# Altium schematic sheet 35.SchDoc
size 513 x 386 mm
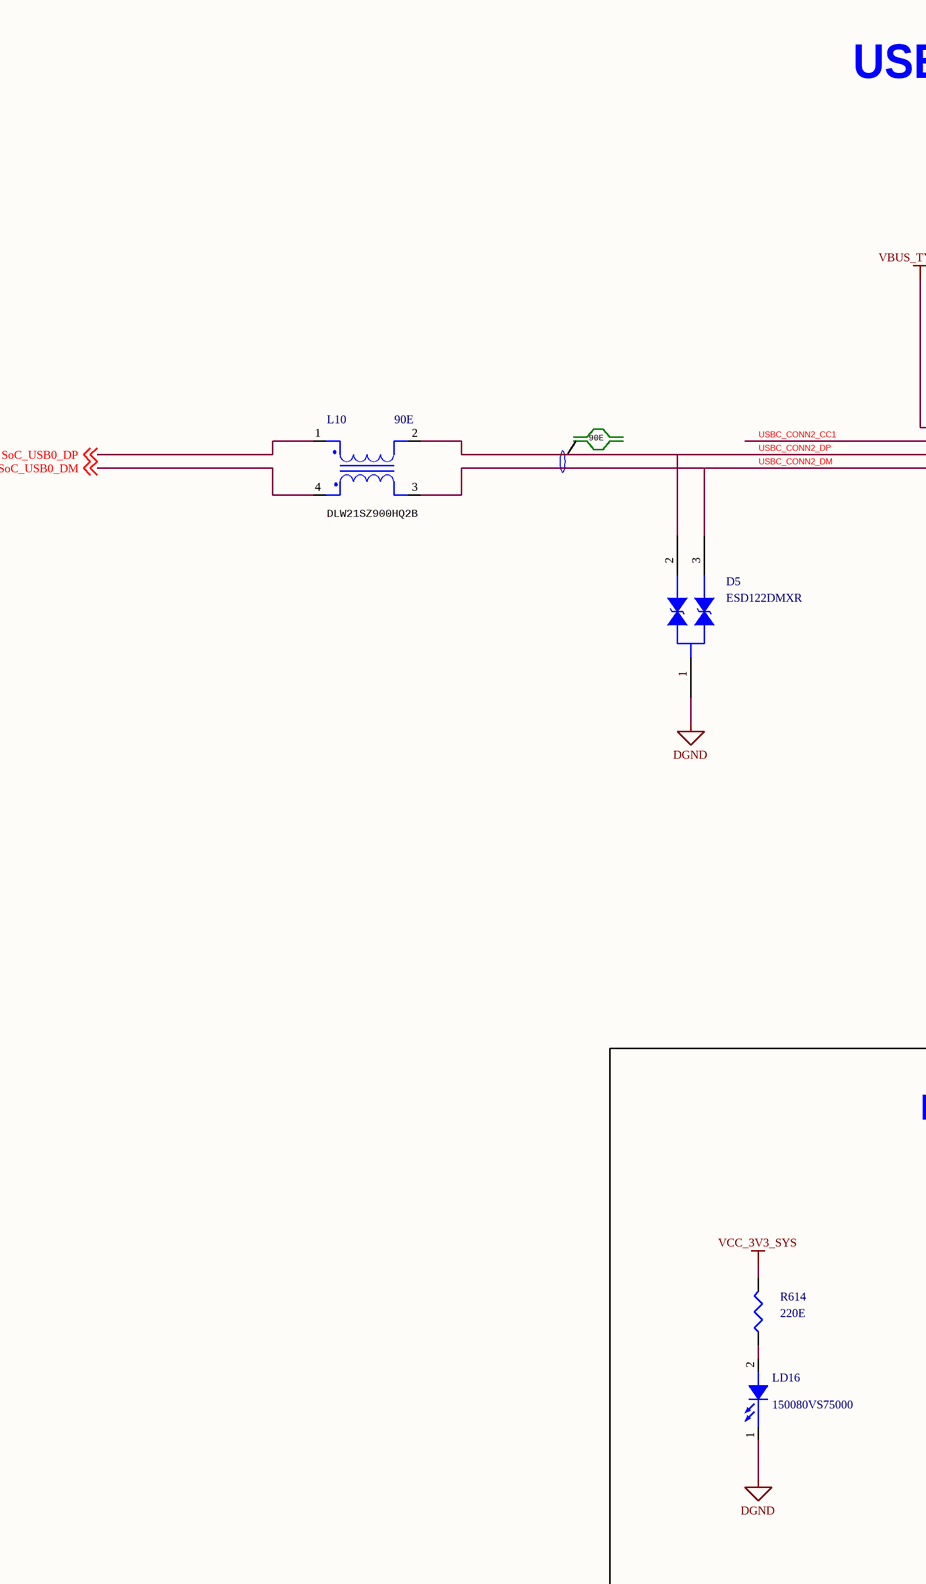
[diagram p0: 35.SchDoc, left]
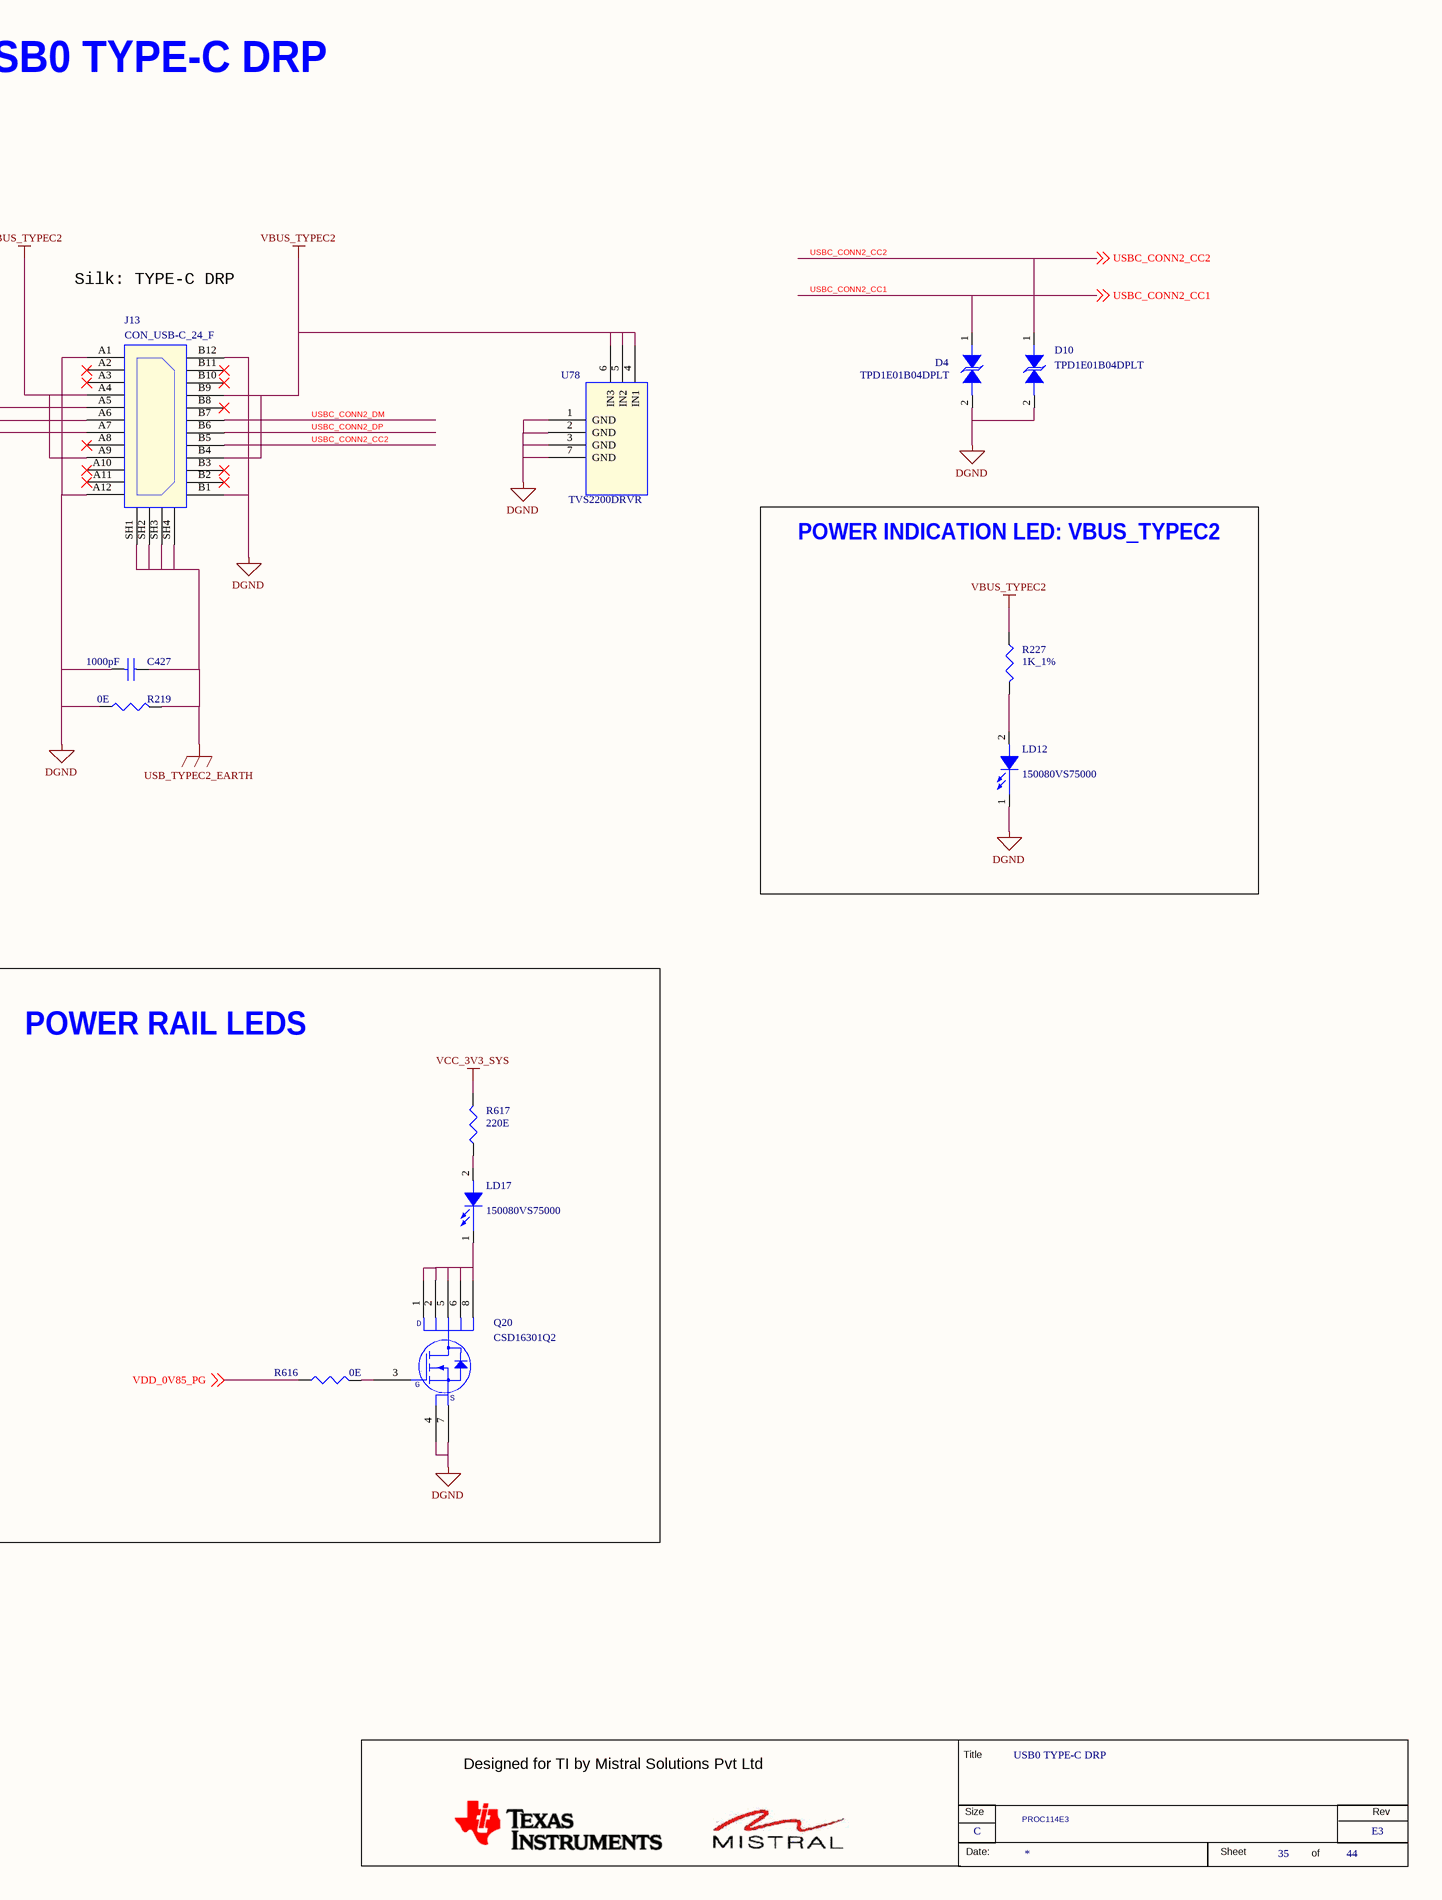
[diagram p1: 35.SchDoc, right]

## Parts
*  RevCode: E3  Title: USB0 TYPE-C DRP  Page Size: C  Page Number: 35  Page Count: 44  Variant Name: PROC114E3  (hidden comment: MISTRAL_TITLEBLK_CSIZE)  (graphical)
C427  1000pF  [CAP1206_1-75]
D4  TPD1E01B04DPLT  [DIO_DFN0201_0-4]
D5  ESD122DMXR  [X2SON3_ESD122DMX_30X40_0-4]
D10  TPD1E01B04DPLT  [DIO_DFN0201_0-4]
J13  CON_USB-C_24_F  [CON_USBC24_2012670_S_R_S_3-9]
L10  90E  [IND4_DLW21H_90X60_SMD_1-4]
LD12  150080VS75000  [LED_150080VS75000_80X50_SMD_0-8]
LD16  150080VS75000  [LED_150080VS75000_80X50_SMD_0-8]
LD17  150080VS75000  [LED_150080VS75000_80X50_SMD_0-8]
Q20  CSD16301Q2  [WSON6_CSD13202Q2_80X80_0-8]
R219  0E  [RES0603_0-75]
R227  1K_1%  [RES0402_0-5]
R614  220E  [RES0402_0-5]
R616  0E  [RES0402_0-5]
R617  220E  [RES0402_0-5]
U78  TVS2200DRVR  [SON6_25-59_85X85_0-8]

## Blocks framed on the sheet
POWER INDICATION LED: VBUS_TYPEC2: LD12 R227
POWER RAIL LEDS: LD16 LD17 Q20 R614 R616 R617

## Nets
DGND: C427.2 D4.2(ANODE) D5.1(GND) D10.2(ANODE) J13.A1(GND) J13.A12(GND) J13.B1(GND) J13.B12(GND) LD12.1(CATHODE) LD16.1(CATHODE) Q20.4(S1) Q20.7(S2) R219.2 U78.1(GND) U78.2(GND) U78.3(GND) U78.7(GND)
USB_TYPEC2_EARTH: C427.1 J13.SH1 J13.SH2 J13.SH3 J13.SH4 R219.1
VBUS_TYPEC2: J13.A4(VBUS1) J13.A9(VBUS2) J13.B4(VBUS3) J13.B9(VBUS4) R227.1 U78.4(IN1) U78.5(IN2) U78.6(IN3)
VCC_3V3_SYS: R614.2 R617.2
SoC_USB0_DM: L10.4(OUT2) ; off-sheet SoC_USB0_DM
SoC_USB0_DP: L10.1(IN1) ; off-sheet SoC_USB0_DP
USBC_CONN2_CC1: D4.1(CATHODE) J13.A5(CC1) ; off-sheet USBC_CONN2_CC1
USBC_CONN2_CC2: D10.1(CATHODE) J13.B5(CC2) ; off-sheet USBC_CONN2_CC2
USBC_CONN2_DM: D5.3(IO2) J13.A7(D-_1) J13.B7(D-_2) L10.3(OUT1)
USBC_CONN2_DP: D5.2(IO1) J13.A6(D+_1) J13.B6(D+_2) L10.2(IN2)
VDD_0V85_PG: R616.1 ; off-sheet VDD_0V85_PG
NetLD12_2: LD12.2(ANODE) R227.2
NetLD16_2: LD16.2(ANODE) R614.1
NetLD17_1: LD17.1(CATHODE) Q20.1(D1) Q20.2(D2) Q20.5(D3) Q20.6(D4) Q20.8(D5)
NetLD17_2: LD17.2(ANODE) R617.1
NetQ20_3: Q20.3(G) R616.2

Not connected (* = marked no-connect by the designer): J13 A2(TX1+)* A3(TX1-)* A8(SBU1)* A10(RX2-)* A11(RX2+)* B2(TX2+)* B3(TX2-)* B8(SBU2)* B10(RX1-)* B11(RX1+)*

## Notes on the sheet
- USB0 TYPE-C DRP
- Silk: TYPE-C DRP
- 90E
- (near L10) DLW21SZ900HQ2B
- (in symbol MISTRAL_TITLEBLK_CSIZE) Title; Designed for TI by Mistral Solutions Pvt Ltd; Size; Rev; Date:; Sheet; of
- (in symbol MOSFET_CSD17313Q2) D; S

## Library data of the parts
* = MISTRAL_TITLEBLK_CSIZE: Issue: 1.0; Page Create Date: March  8, 1995; Page Modify Date: *
C427 = CAP_Dup2: CAP CERAMIC 1000pF 2KV 10% X7R 1206; Mistral Part No: 120015080006-R; Mfr_name: AVX CORPORATION; Mfr_part_number: 1206GC102KAT1A; Part_type: CAPACITORS\CERAMIC; Project: ADR1B; Customs_HS_Code: 85322990; Custom_Duty: 15%; Wattage: NA; Tolerance: 10%; Voltage: 2KV; Package: 1206; Distributor_name: DIGIKEY; Distributor_part_number: 478-2956-1-ND; Height: 1.52MM; Weight: 16.2mg; Temperature: -55°C+125°C; Datasheet: Y:\MIS_DATABASE\DATASHEETS\CAPACITORS\AVX_HV-MLC.PDF; Crtd /date: MAZHAR/281106; Chkd/date: SHREESHAIL/291106; Library Ref: CAP; Footprint Ref: CAP1206_1-75; Library Path: Y:\MIS_DATABASE\Library\ALTIUM_TOOL\SCHEMATICS_PARTS\MS_DISCRETE_Library.schlib; Footprint Path: Y:\MIS_DATABASE\Library\ALTIUM_TOOL\PCB_FOOTPRINTS\Altium_Footprint_Lib.PcbLib; MECHANICAL 3D STEP FILE: CAP1206_1-75; PCB Footprint: CAP1206_1-75
D4 = DIODE_TVS_DUAL: DIODE 1CH ESD PROTECTION FOR USB TYPE-C AND THUNDERBOLT3 X2SON2; Mistral Part No: 130020090037-R; Mfr_name: TEXAS INSTRUMENTS; Part_type: DIODE\TVS; Project: AM64X_SKEVM; Tolerance: NA; Customs_HS_Code: 85412900; Custom_Duty: 15%; Footprint Ref: DIO_DFN0201_0-4; Mfr_part_number: TPD1E01B04DPLT; Voltage: NA; Wattage: NA; Package: X2SON2; Distributor_name: DIGIKEY; Distributor_part_number: 296-44484-1-ND; Library Ref: DIODE_TVS_DUAL; Height: 0.32MM; Weight: 0.2mg; Temperature: -40°C+125°C; Datasheet: Y:\MIS_DATABASE\DATASHEETS\DISCRETES\DIODES\TPD1E01B04.PDF; Crtd /date: ALVY/230920; Chkd/date: MANIRAJA/230920; MECHANICAL 3D STEP FILE: DIO_DFN0201_0-4; Library Path: Y:\MIS_DATABASE\Library\ALTIUM_TOOL\SCHEMATICS_PARTS\MS_DISCRETE_Library.schlib; Footprint Path: Y:\MIS_DATABASE\Library\ALTIUM_TOOL\PCB_FOOTPRINTS\Altium_Footprint_Lib.PcbLib; PCB Footprint: DIO_DFN0201_0-4
D5 = DIODE_ESD122DMXR: DIODE 2-CH ESD PROTECTION FOR USB TYPE-C AND HDMI 2.0 X2SON-3; Part_type: DIODE\TVS; Mfr_name: TEXAS INSTRUMENTS; Mistral Part No: 130017080015-R; Custom_Duty: 15%; Customs_HS_Code: 85412900; Wattage: NA; Project: TI_SVB_CONTROLLER CARD; MECHANICAL 3D STEP FILE: X2SON3_ESD122DMX_30X40_0-4; Chkd/date: MANIRAJA/140817; Crtd /date: MANIRAJA/140817; Datasheet: Y:\MIS_DATABASE\DATASHEETS\DISCRETES\DIODES\ESD122XX.PDF; Temperature: -40°C+125°C; Weight: NA; Height: 0.40MM; Library Ref: DIODE_ESD122DMXR; Distributor_part_number: ESD122DMXR-ND; Distributor_name: DIGIKEY; Package: X2SON-3; Voltage: NA; Tolerance: NA; Mfr_part_number: ESD122DMXR; PCB Footprint: X2SON3_ESD122DMX_30X40_0-4
D10 = DIODE_TVS_DUAL: DIODE 1CH ESD PROTECTION FOR USB TYPE-C AND THUNDERBOLT3 X2SON2; Part_type: DIODE\TVS; Mfr_name: TEXAS INSTRUMENTS; Mistral Part No: 130020090037-R; Custom_Duty: 15%; Customs_HS_Code: 85412900; Wattage: NA; Project: AM64X_SKEVM; Footprint Path: Y:\MIS_DATABASE\Library\ALTIUM_TOOL\PCB_FOOTPRINTS\Altium_Footprint_Lib.PcbLib; Library Path: Y:\MIS_DATABASE\Library\ALTIUM_TOOL\SCHEMATICS_PARTS\MS_DISCRETE_Library.schlib; MECHANICAL 3D STEP FILE: DIO_DFN0201_0-4; Chkd/date: MANIRAJA/230920; Crtd /date: ALVY/230920; Datasheet: Y:\MIS_DATABASE\DATASHEETS\DISCRETES\DIODES\TPD1E01B04.PDF; Temperature: -40°C+125°C; Weight: 0.2mg; Height: 0.32MM; Library Ref: DIODE_TVS_DUAL; Distributor_part_number: 296-44484-1-ND; Distributor_name: DIGIKEY; Package: X2SON2; Voltage: NA; Tolerance: NA; Mfr_part_number: TPD1E01B04DPLT; Footprint Ref: DIO_DFN0201_0-4; PCB Footprint: DIO_DFN0201_0-4
J13 = CON_USB-C_24_1240183621: CON USB-C TYPE 24POS FEMALE RT SMD; Part_type: CONNECTOR\USB; Mfr_part_number: 2012670005; Mfr_name: MOLEX; Mistral Part No: 150018060002-R; Custom_Duty: 24%; Customs_HS_Code: 85369090; Wattage: NA; Project: TI_J7SVB_USB_ADD-ON-CARD; Footprint Path: Y:\MIS_DATABASE\Library\ALTIUM_TOOL\PCB_FOOTPRINTS\Altium_Footprint_Lib.PcbLib; Library Path: Y:\MIS_DATABASE\Library\ALTIUM_TOOL\SCHEMATICS_PARTS\MS_CONNECTOR_Library.schlib; MECHANICAL 3D STEP FILE: CON_USBC24_2012670_S_R_S_3-9; Chkd/date: MANIRAJA/050618; Crtd /date: ALVY/040618; Datasheet: Y:\MIS_DATABASE\DATASHEETS\CONNECTORS\2012670X.PDF; Temperature: -40°C+105°C; Weight: 0.686g; Height: 3.86MM; Library Ref: CON_USB-C_24_1240183621; Distributor_part_number: WM17992CT-ND; Distributor_name: DIGIKEY; Package: SMD; Voltage: NA; Tolerance: NA; Footprint Ref: CON_USBC24_2012670_S_R_S_3-9; PCB Footprint: CON_USBC24_2012670_S_R_S_3-9
L10 = INDUCTOR_DLW31S: IND COMMON MODE CHOKE 90E 280mA SMD; Mfr_part_number: DLW21SZ900HQ2B; Mfr_name: MURATA; Mistral Part No: 130019060035-R; Custom_Duty: 24%; Customs_HS_Code: 85437099; Wattage: NA; Project: TI_J7ES_CP; Footprint Path: Y:\MIS_DATABASE\Library\ALTIUM_TOOL\PCB_FOOTPRINTS\Altium_Footprint_Lib.PcbLib; Library Path: Y:\MIS_DATABASE\Library\ALTIUM_TOOL\SCHEMATICS_PARTS\MS_DISCRETE_Library.schlib; MECHANICAL 3D STEP FILE: IND4_DLW21H_90X60_SMD_1-4; Chkd/date: MANIRAJA/270619; Crtd /date: MANIRAJA/270619; Datasheet: Y:\MIS_DATABASE\DATASHEETS\DISCRETES\INDUCTORS\DLW21SZ900HQ2B.PDF; Temperature: -40°C+105°C; Weight: 11mg; Height: 1.40MM; Footprint Ref: IND4_DLW21H_90X60_SMD_1-4; Library Ref: INDUCTOR_DLW31S; Distributor_part_number: NA; Distributor_name: NA; Package: SMD; Voltage: NA; Tolerance: NA; Part_type: INDUCTOR; PCB Footprint: IND4_DLW21H_90X60_SMD_1-4
LD12 LD17 = DIODE_LED: DIODE LED BRIGHT GREEN SMD; Mistral Part No: 130020080012-R; Mfr_name: WURTH ELECTRONICS; Part_type: OPTO\LED; Project: AM64x_EVM_BRD; Tolerance: NA; Customs_HS_Code: 85439000; Custom_Duty: 24%; Footprint Ref: LED_150080VS75000_80X50_SMD_0-8; Mfr_part_number: 150080VS75000; Voltage: NA; Wattage: NA; Package: SMD; Distributor_name: DIGIKEY; Distributor_part_number: 732-4986-1-ND; Library Ref: DIODE_LED; Height: 0.80MM; Weight: 10mg; Temperature: -40°C+85°C; Datasheet: Y:\MIS_DATABASE\DATASHEETS\DISCRETES\LEDS\150080VS75000.PDF; Crtd /date: ALVY/180820; Chkd/date: MANIRAJA/180820; MECHANICAL 3D STEP FILE: LED_150080VS75000_80X50_SMD_0-8; Library Path: Y:\MIS_DATABASE\Library\ALTIUM_TOOL\SCHEMATICS_PARTS\MS_OPTO_Library.schlib; Footprint Path: Y:\MIS_DATABASE\Library\ALTIUM_TOOL\PCB_FOOTPRINTS\Altium_Footprint_Lib.PcbLib; PCB Footprint: LED_150080VS75000_80X50_SMD_0-8
LD16 = DIODE_LED: DIODE LED BRIGHT GREEN SMD; Part_type: OPTO\LED; Mfr_name: WURTH ELECTRONICS; Mistral Part No: 130020080012-R; Custom_Duty: 24%; Customs_HS_Code: 85439000; Wattage: NA; Project: AM64x_EVM_BRD; PCB Footprint: LED_150080VS75000_80X50_SMD_0-8; Footprint Path: Y:\MIS_DATABASE\Library\ALTIUM_TOOL\PCB_FOOTPRINTS\Altium_Footprint_Lib.PcbLib; Library Path: Y:\MIS_DATABASE\Library\ALTIUM_TOOL\SCHEMATICS_PARTS\MS_OPTO_Library.schlib; MECHANICAL 3D STEP FILE: LED_150080VS75000_80X50_SMD_0-8; Chkd/date: MANIRAJA/180820; Crtd /date: ALVY/180820; Datasheet: Y:\MIS_DATABASE\DATASHEETS\DISCRETES\LEDS\150080VS75000.PDF; Temperature: -40°C+85°C; Weight: 10mg; Height: 0.80MM; Library Ref: DIODE_LED; Distributor_part_number: 732-4986-1-ND; Distributor_name: DIGIKEY; Package: SMD; Voltage: NA; Tolerance: NA; Mfr_part_number: 150080VS75000; Footprint Ref: LED_150080VS75000_80X50_SMD_0-8
Q20 = MOSFET_CSD17313Q2: IC MOSFET N-CHANNEL NEXFET 25V WSON6; Part_type: ICS\POWER\MOSFET; Mfr_name: TEXAS INSTRUMENTS; Mistral Part No: 142020120008-R; Custom_Duty: 15%; Customs_HS_Code: 85423100; Wattage: NA; Project: TI_AM243x LP EVM; PCB Footprint: WSON6_CSD13202Q2_80X80_0-8; Footprint Path: Y:\MIS_DATABASE\Library\ALTIUM_TOOL\PCB_FOOTPRINTS\Altium_Footprint_Lib.PcbLib; Library Path: Y:\MIS_DATABASE\Library\ALTIUM_TOOL\SCHEMATICS_PARTS\MS_MOSFET_Library.schlib; MECHANICAL 3D STEP FILE: WSON6_CSD13202Q2_80X80_0-8; Chkd/date: ALVY/071220; Crtd /date: MANIRAJA/071220; Datasheet: Y:\MIS_DATABASE\DATASHEETS\ICS\POWER\CSD16301Q2.PDF; Temperature: -55°C+150°C; Weight: 8.7mg; Height: 0.80MM; Library Ref: MOSFET_CSD17313Q2; Distributor_part_number: 296-25260-1-ND; Distributor_name: DIGIKEY; Package: WSON6; Voltage: NA; Tolerance: NA; Mfr_part_number: CSD16301Q2; Footprint Ref: WSON6_CSD13202Q2_80X80_0-8
R219 = RESISTOR_Dup6: RES 0E 1/10W 5% 0603; Manufacturer: YAGEO AMERICA; Part_type: RESISTORS\FIXED; Mfr_part_number: RC0603JR-070RL; Mfr_name: PANASONIC-ECG; Mistral Part No: 110011020013-R; Custom_Duty: 15%; Customs_HS_Code: 85332119; Voltage: NA; Project: KENNEL; MECHANICAL 3D STEP FILE: RES0603_0-75; Chkd/date: MANIRAJA/051217; Crtd /date: BAVISH/180211; Datasheet: Y:\MIS_DATABASE\DATASHEETS\RESISTORS\RCXXXXL-SER_MAR18.PDF; Temperature: -55°C+155°C; Weight: 2mg; Height: 0.55MM; Distributor_part_number: 311-0.0GRCT-ND; Distributor_name: DIGIKEY; Package: 0603; Wattage: 1/10W; Tolerance: 5%; Library Ref: RESISTOR; Footprint Ref: RES0603_0-75; Library Path: Y:\MIS_DATABASE\Library\ALTIUM_TOOL\SCHEMATICS_PARTS\MS_DISCRETE_Library.schlib; Footprint Path: Y:\MIS_DATABASE\Library\ALTIUM_TOOL\PCB_FOOTPRINTS\Altium_Footprint_Lib.PcbLib; PCB Footprint: RES0603_0-75
R227 = RESISTOR_Dup6: RES 1K 1/10W 1% 0402; Mistral Part No: 110009030411-R; Mfr_name: PANASONIC-ECG; Mfr_part_number: ERJ-2RKF1001X; Part_type: RESISTORS\FIXED; Project: VOCERA; Voltage: NA; Customs_HS_Code: 85332119; Custom_Duty: 15%; Footprint Ref: RES0402_0-5; Tolerance: 1%; Wattage: 1/10W; Package: 0402; Distributor_name: DIGIKEY; Distributor_part_number: P1.00KLCT-ND; Library Ref: RESISTOR; Height: 0.40MM; Weight: 0.8mg; Temperature: -55°C+155°C; Datasheet: Y:\MIS_DATABASE\DATASHEETS\RESISTORS\PAN-ERJSER_NOV17.PDF; Crtd /date: MAZHAR/150506; Chkd/date: VASANTHA/281216; MECHANICAL 3D STEP FILE: RES0402_0-5; Library Path: Y:\MIS_DATABASE\Library\ALTIUM_TOOL\SCHEMATICS_PARTS\MS_DISCRETE_Library.schlib; Footprint Path: Y:\MIS_DATABASE\Library\ALTIUM_TOOL\PCB_FOOTPRINTS\Altium_Footprint_Lib.PcbLib; PCB Footprint: RES0402_0-5
R614 = RESISTOR_Dup6: RES 220E 1/10W 5% 0402; Mistral Part No: 110009030506-R; Mfr_name: PANASONIC-ECG; Mfr_part_number: ERJ-2GEJ221X; Part_type: RESISTORS\FIXED; Project: RED EYE; Customs_HS_Code: 85332119; Custom_Duty: 15%; Voltage: NA; PCB Footprint: RES0402_0-5; Footprint Ref: RES0402_0-5; Tolerance: 5%; Wattage: 1/10W; Package: 0402; Distributor_name: DIGIKEY; Distributor_part_number: P220JCT-ND; Height: 0.40MM; Datasheet: Y:\MIS_DATABASE\DATASHEETS\RESISTORS\PAN-ERJSER_NOV17.PDF; Crtd /date: GEETHA/260406; Chkd/date: VASANTHA/291216; Library Ref: RESISTOR; Weight: 0.8mg; Temperature: -55°C+155°C; MECHANICAL 3D STEP FILE: RES0402_0-5; Library Path: Y:\MIS_DATABASE\Library\ALTIUM_TOOL\SCHEMATICS_PARTS\MS_DISCRETE_Library.schlib; Footprint Path: Y:\MIS_DATABASE\Library\ALTIUM_TOOL\PCB_FOOTPRINTS\Altium_Footprint_Lib.PcbLib
R616 = RESISTOR_Dup6: RES 0E 1/16W JUMPER 0402; Mistral Part No: 110010080019-R; Mfr_name: VISHAY; Mfr_part_number: CRCW04020000Z0ED; Part_type: RESISTORS\FIXED; Project: PB_BUGBASE; Tolerance: NA; Customs_HS_Code: 85332119; Custom_Duty: 15%; PCB Footprint: RES0402_0-5; Footprint Ref: RES0402_0-5; Voltage: NA; Wattage: 1/16W; Package: 0402; Distributor_name: DIGIKEY; Distributor_part_number: 541-0.0JCT-ND; Library Ref: RESISTOR; Height: 0.40MM; Weight: 0.65mg; Temperature: -55°C+155°C; Datasheet: Y:\MIS_DATABASE\DATASHEETS\RESISTORS\CRCW0603.PDF; Crtd /date: MUDDU/190810; Chkd/date: VASANTHA/201216; MECHANICAL 3D STEP FILE: RES0402_0-5; Library Path: Y:\MIS_DATABASE\Library\ALTIUM_TOOL\SCHEMATICS_PARTS\MS_DISCRETE_Library.schlib; Footprint Path: Y:\MIS_DATABASE\Library\ALTIUM_TOOL\PCB_FOOTPRINTS\Altium_Footprint_Lib.PcbLib
R617 = RESISTOR_Dup6: RES 220E 1/10W 5% 0402; Part_type: RESISTORS\FIXED; Mfr_part_number: ERJ-2GEJ221X; Mfr_name: PANASONIC-ECG; Mistral Part No: 110009030506-R; Voltage: NA; Custom_Duty: 15%; Customs_HS_Code: 85332119; Project: RED EYE; PCB Footprint: RES0402_0-5; Footprint Path: Y:\MIS_DATABASE\Library\ALTIUM_TOOL\PCB_FOOTPRINTS\Altium_Footprint_Lib.PcbLib; Library Path: Y:\MIS_DATABASE\Library\ALTIUM_TOOL\SCHEMATICS_PARTS\MS_DISCRETE_Library.schlib; MECHANICAL 3D STEP FILE: RES0402_0-5; Temperature: -55°C+155°C; Weight: 0.8mg; Library Ref: RESISTOR; Chkd/date: VASANTHA/291216; Crtd /date: GEETHA/260406; Datasheet: Y:\MIS_DATABASE\DATASHEETS\RESISTORS\PAN-ERJSER_NOV17.PDF; Height: 0.40MM; Distributor_part_number: P220JCT-ND; Distributor_name: DIGIKEY; Package: 0402; Wattage: 1/10W; Tolerance: 5%; Footprint Ref: RES0402_0-5
U78 = TVS2200_WSON6: IC 22V FLAT-CLAMP SURGE PROTECTION DEVICE WSON6; Part_type: ICS\POWER; Mfr_name: TEXAS INSTRUMENTS; Mistral Part No: 142021100001-R; Custom_Duty: 15%; Customs_HS_Code: 85423100; Wattage: NA; Project: TI_AM62x SKEVM_BRD; Footprint Path: Y:\MIS_DATABASE\Library\ALTIUM_TOOL\PCB_FOOTPRINTS\Altium_Footprint_Lib.PcbLib; Library Path: Y:\MIS_DATABASE\Library\ALTIUM_TOOL\SCHEMATICS_PARTS\MS_MISCPOWER_Library.schlib; MECHANICAL 3D STEP FILE: SON6_25-59_85X85_0-8; Chkd/date: MANIRAJA/011021; Crtd /date: ALVY/011021; Datasheet: Y:\MIS_DATABASE\DATASHEETS\ICS\POWER\TVS2200.PDF; Temperature: -40°C+125°C; Weight: 12mg; Height: 0.80MM; Footprint Ref: SON6_25-59_85X85_0-8; Library Ref: TVS2200_WSON6; Distributor_part_number: 296-52187-1-ND; Distributor_name: DIGIKEY; Package: WSON6; Voltage: NA; Tolerance: NA; Mfr_part_number: TVS2200DRVR; PCB Footprint: SON6_25-59_85X85_0-8